# Altium schematic sheet Transmitter.SchDoc
size 127 x 101 mm; SheetNumber: 4; SheetTotal: 4
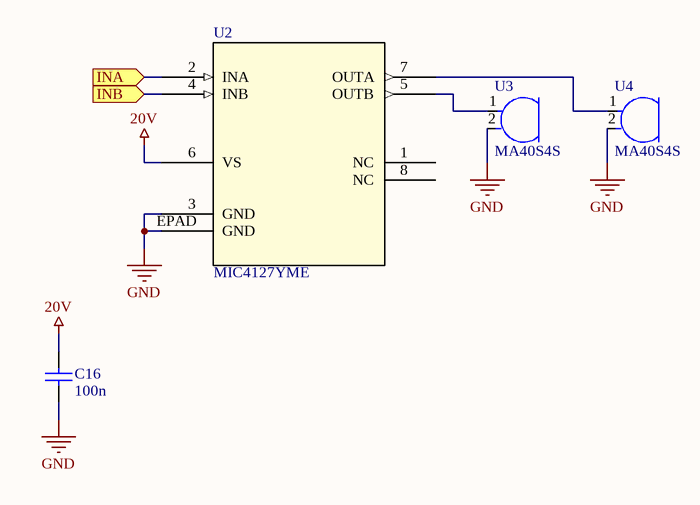
[diagram p0: Transmitter.SchDoc]

## Parts
C16  100n  [SAMS-C0603-2_M]
U2  MIC4127YME  [SOIC8_EQA_MCH]
U3  MA40S4S  [FP-MA40S4S-MFG]
U4  MA40S4S  [FP-MA40S4S-MFG]

## Ports
INA (in), INB (in)

## Nets
20V: C16.2 U2.6(VS)
GND: C16.1 U2.3(GND) U2.EPAD(GND) U3.2 U4.2
INA: U2.2(INA) ; port INA
INB: U2.4(INB) ; port INB
NetU2_5: U2.5(OUTB) U3.1
NetU2_7: U2.7(OUTA) U4.1

Not connected (* = marked no-connect by the designer): U2 1(NC) 8(NC)

## Library data of the parts
C16 = CMP-2000-05332-1: Multi-layer Ceramic Capacitor, -55 to 125 degC, 2-Pin SMD (0603), RoHS, Tape and Reel; Manufacturer: Samsung Electro-Mechanics; Capacitance: 0.1µF; Rated Voltage: 50V; Dielectric: X7R; Tolerance (%): ±10%; Case Size/Dimension: 0603; Datasheet URL: https://datasheet.ciiva.com/29198/456651-da-01-en-vs-kondensator-0605-29198839.pdf; Manufacturer URL: http://www.samsungsem.com/global/index.jsp; Datasheet Version: Nov-10
U2 = MIC4127YME: No Description Available; Mfr_Name: Microchip; Copyright: Copyright (C) 2022 Ultra Librarian. All rights reserved.; Manufacturer_Part_Number: MIC4127YME; RefDes: RefDes; Type: DEV
U3 U4 = CMP-06153-000002-1: ULTRASONIC SENSOR TRANS 40KHZ; Voltage Rating: 20V; Capacitance: 2.55nF; Outside Diameter: 9.9mm; Max Operating Temperature: 85°C; Radiation Hardening: No; Frequency: 40kHz; Self Resonant Frequency: 40kHz; Mount: PCB; Voltage Rating (DC): 20V; Number of Pins: 2; Package Quantity: 100; Operating Supply Voltage: 20V; Lead Free: Lead Free; Termination: PCB; Length: 7.1mm; Min Operating Temperature: -40°C; Height: 7.1mm; REACH SVHC: No SVHC; Switching Frequency: 40kHz; Diameter: 10mm